# EAGLE design powersafe2 (EAGLE 7.7.0)
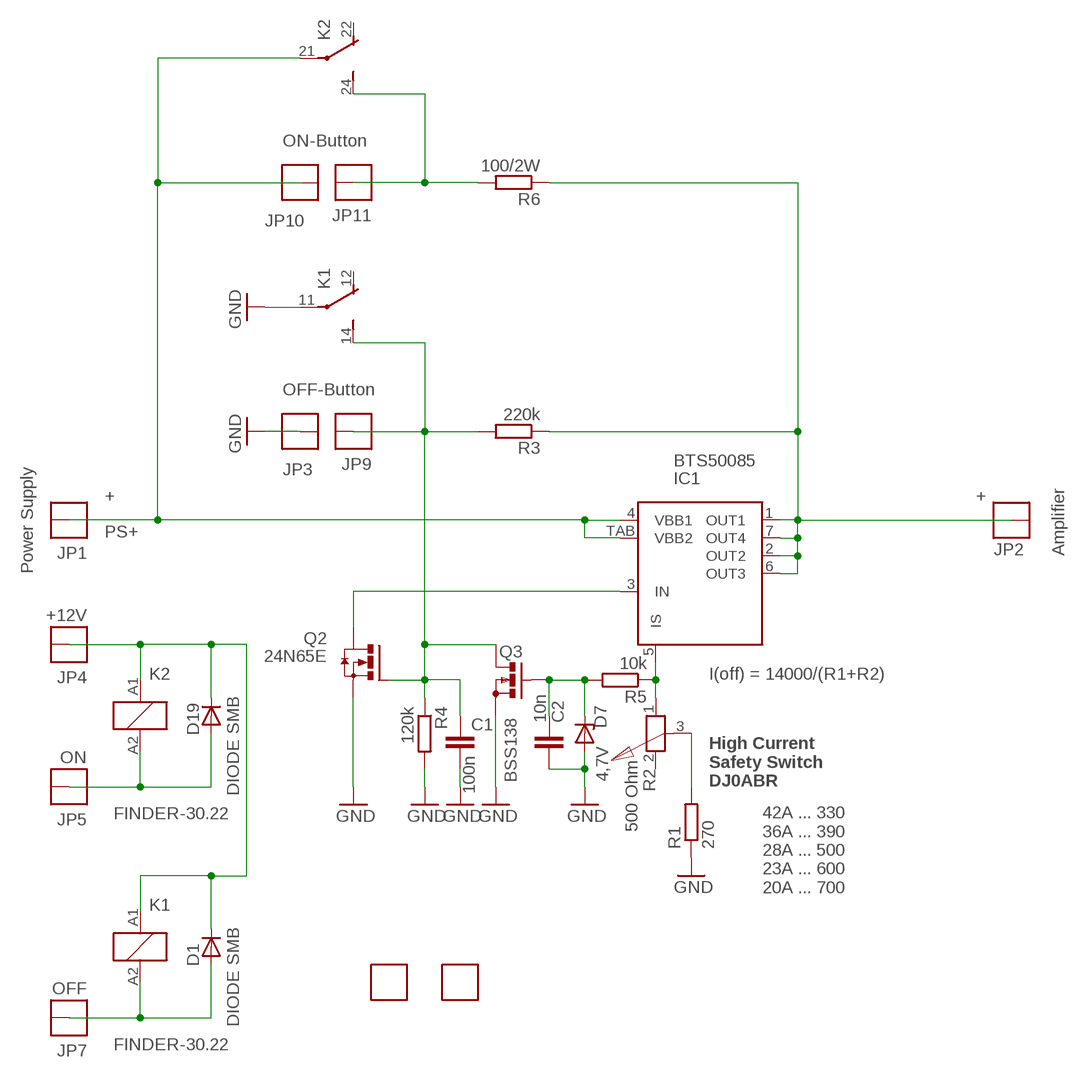
[diagram p0: schematic, sheet 1]

## Parts
C1  100n  C-EUC0603K  [C0603K]
C2  10n  C-EUC0603K  [C0603K]
D1  DIODE SMB  DIODE-SMB  [SMB]
D7  4,7V  ZPYSMA  [SMA]
D19  DIODE SMB  DIODE-SMB  [SMB]
FID1  FIDUCIAL  [FIDUCIAL]
FID2  FIDUCIAL  [FIDUCIAL]
IC1  BTS50085  [PG-TO220-7-4]
JP1  THICKPINPIN_4QMM  [PIN_4QMM]
JP2  THICKPINPIN_4QMM  [PIN_4QMM]
JP3  THICKPINSQUARE  [THICKPIN]
JP4  +12V  THICKPINOCT  [THICKPIN_OCT]
JP5  ON  THICKPINOCT  [THICKPIN_OCT]
JP7  OFF  THICKPINOCT  [THICKPIN_OCT]
JP9  THICKPINSQUARE  [THICKPIN]
JP10  THICKPINSQUARE  [THICKPIN]
JP11  THICKPINSQUARE  [THICKPIN]
K1  FINDER-30.22  [FINDER-30.22]
K2  FINDER-30.22  [FINDER-30.22]
Q2  24N65E  IRF3704S  [D2PACK]
Q3  BSS138  BS170_SMD  [SOT23]
R1  270  R-EU_R0603  [R0603]
R2  500 Ohm  MINIPOTI-S  [MINIPOTI]
R3  220k  R-EU_R0603  [R0603]
R4  120k  R-EU_R0603  [R0603]
R5  10k  R-EU_R0603  [R0603]
R6  100/2W  R-EU_0613/15  [P0613/15]

## Nets
GND: C1.2 C2.2 D7.A JP3.1 K1.11(-1:P) Q2.3(S) Q3.2(S) R1.1 R4.2
N$1: C2.1 D7.C Q3.1(G) R5.2
N$2: IC1.3(IN) Q2.2(D)
N$3: C1.1 JP9.1 K1.14(-1:S) Q2.1(G) Q3.3(D) R3.2 R4.1
N$4: IC1.5(IS) R2.1 R5.1
N$5: JP11.1 K2.24(-2:S) R6.2
N$7: D19.A JP5.1 K2.A2
N$8: D1.C D19.C JP4.1 K1.A1 K2.A1
N$9: R1.2 R2.3
N$10: D1.A JP7.1 K1.A2
PA+: IC1.1(OUT1) IC1.2(OUT2) IC1.6(OUT3) IC1.7(OUT4) JP2.P$1 R3.1 R6.1
PS+: IC1.4(VBB1) IC1.TAB(VBB2) JP1.P$1 JP10.1 K2.21(-2:P)
Unconnected: FID1.P$1 FID2.P$1 K1.12(-1:O) K1.21(-2:P) K1.22(-2:O) K1.24(-2:S) K2.11(-1:P) K2.12(-1:O) K2.14(-1:S) K2.22(-2:O) R2.2

## Notes on the sheet
- ON-Button
- OFF-Button
- + | +
- Amplifier
- Power Supply
- I(off) = 14000/(R1+R2)
- High Current
  Safety Switch
  DJ0ABR
- 42A ... 330
  36A ... 390
  28A ... 500
  23A ... 600
  20A ... 700

## Library data of the parts
C1 C2 = rcl:C-EU: CAPACITOR, European symbol
D1 D19 = diode:DIODE-: DIODE
D7 = km:ZPY: Z DIODE 1 W
FID1 FID2 = km:FIDUCIAL
IC1 = km:BTS50085
JP1-JP5 JP7 JP9-JP11 = km:THICKPIN
K1 K2 = relay:FINDER-30.22: SUBMINIATURE DIL-RELAIS FINDER 30.22.9.024.0000 Kontakt max. AC - 125V Distributor: Farnell Bestell Nr.: 1217371 Source: http://www.farnell.com/datasheets/87634.pdf; OC_FARNELL: unknown; OC_NEWARK: unknown
Q2 = km:IRF3704: SMPS MOSFET HEXFET® Power MOSFET Source: http://www.irf.com/product-info/datasheets/data/irf3704.pdf
Q3 = km:BS170_: N-CHANNEL MOS FET
R1 R3-R6 = rcl:R-EU_: RESISTOR, European symbol
R2 = km:MINIPOTI-S

## Net classes
1 dick: width 0.61 mm

## Board
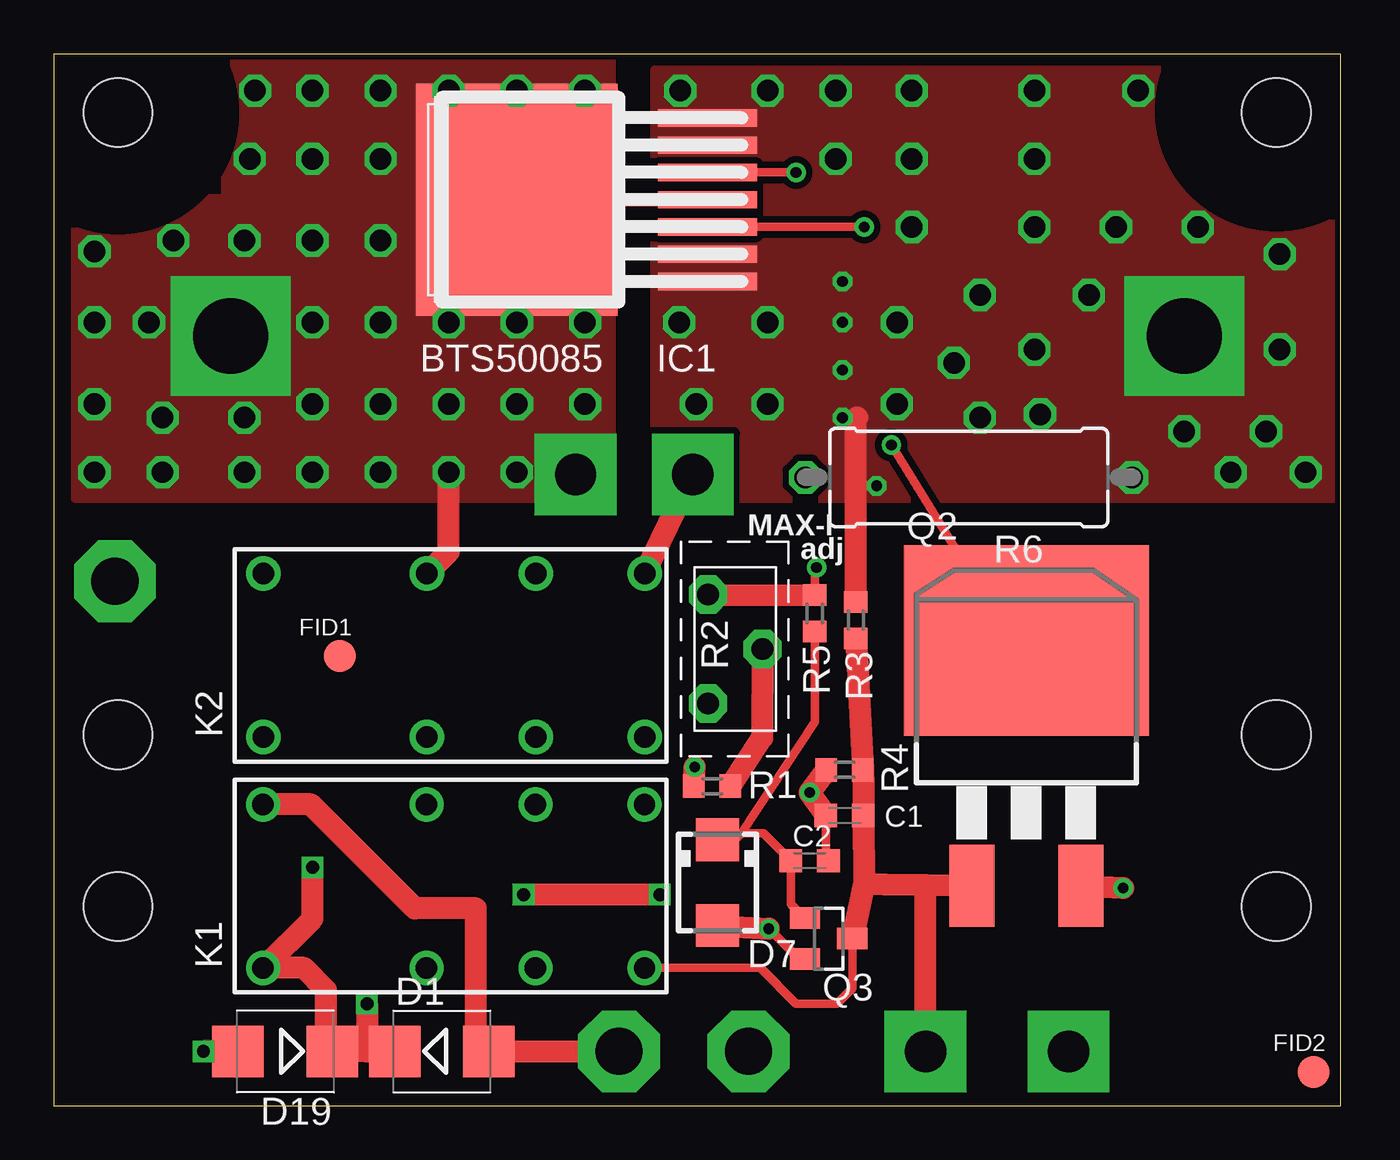
[diagram p1: board, top side]
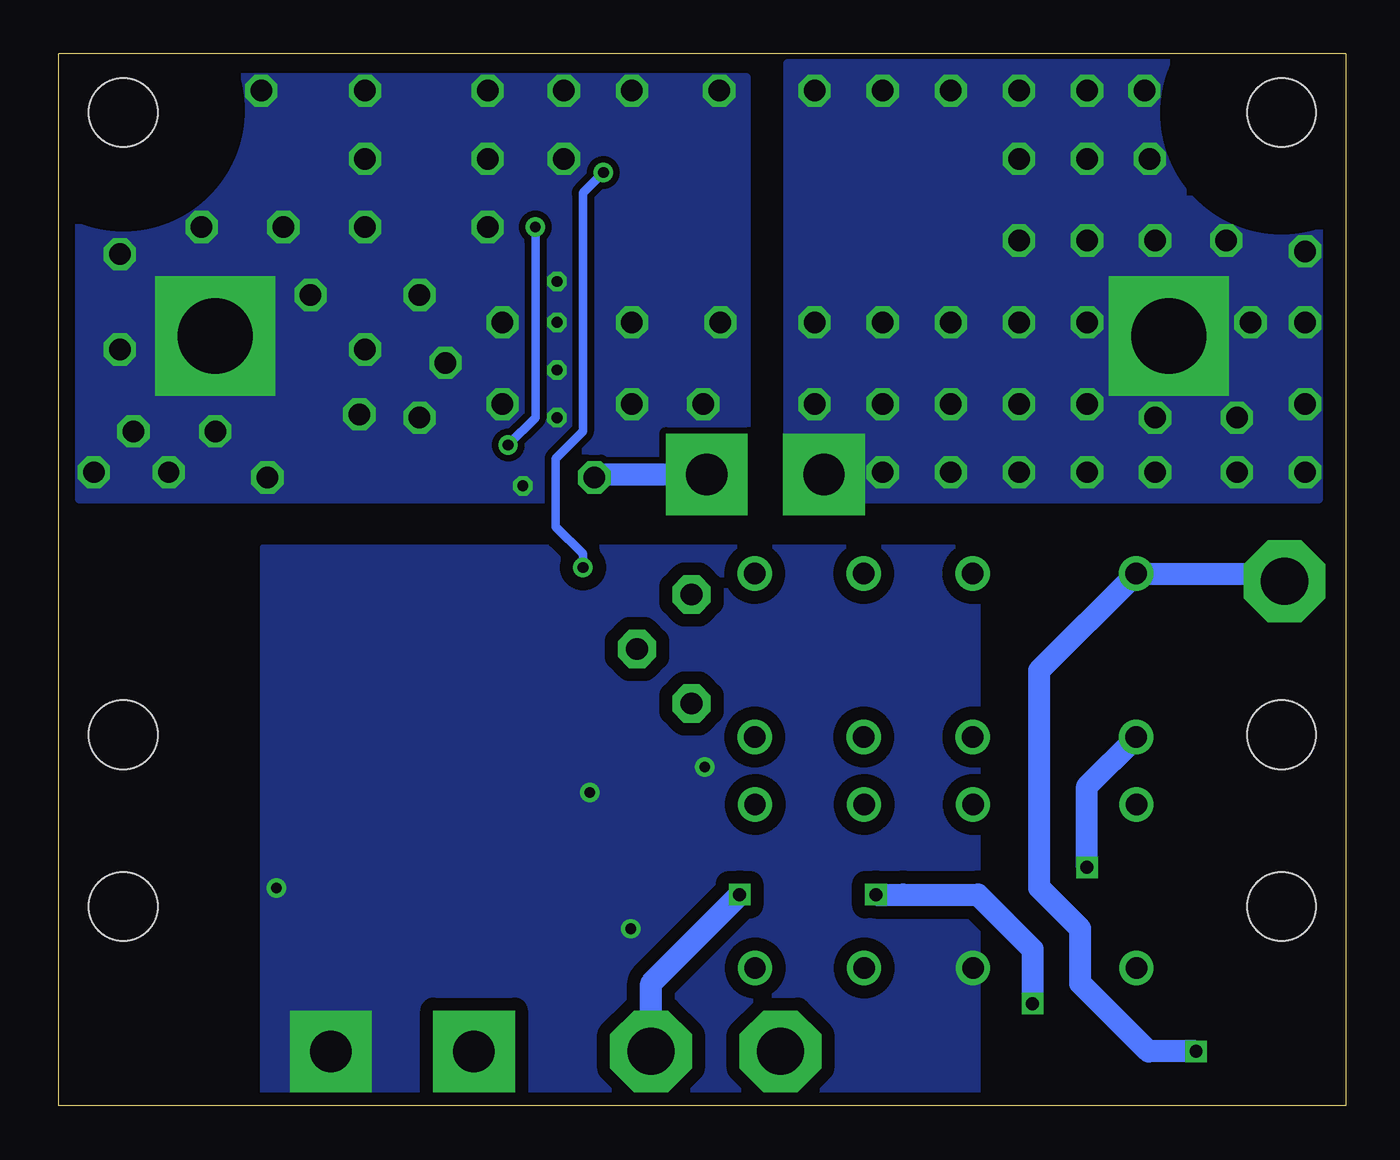
[diagram p2: board, bottom side, seen from below]

Size 60 x 49.03 mm. Coordinates in mm from the lower left corner, seen from the top.
Outline: 0,49.03 60,49.03 60,0 0,0 0,49.03
Copper layers (1*16): Top 0.035mm / dielectric 1.5mm / Bottom 0.035mm
Design rules "default *": minimum track width 10mil, minimum drill 0.25mm, track to track 12mil, track to pad 12mil, pad to pad 12mil, via to via 12mil, smd to smd 0mil, copper to edge 10mil, drill to drill 8mil, minimum pad ring 10mil, minimum via ring 8mil, stop-mask expansion 4mil, vias tented up to drill 1mm, thermal gap 10mil
Holes 3.2 mm at 3,17.29 3,46.29 57,46.29 57,17.29 3,9.29 57,9.29
tRestrict: area -2.7,40.6 to 8.7,51.9; area 51.3,40.7 to 62.7,52.1
bRestrict: area -1.2,12.7 to 7.6,21.6; area 51.9,12.2 to 62.4,22.7; area -2.7,40.6 to 8.7,51.9; area 51.3,40.7 to 62.7,52.1

### Footprints (pad centres in the part's own frame; a part is rotated, then mirrored left to right if it is on the bottom)
C0603K = smd 1.05 x 1.08: 1 -0.875,0; 2 0.875,0
SMB = smd 2.4 x 2.4: A 2.2,0; C -2.2,0
SMA = smd 2 x 2: A 2,0; C -2,0
FIDUCIAL = smd 1.5 x 1.5: P$1 0,0
PG-TO220-7-4 = smd 0.8 x 4.6: 1 -3.81,0; 2 -2.54,0; 3 -1.27,0; 4 0,0; 5 1.27,0; 6 2.54,0; 7 3.81,0 | smd 10.8 x 9.4: TAB 0,8.89
PIN_4QMM = drill 3.5 pad 5.588 square: P$1 0,0
THICKPIN = drill 1.93 pad 3.81 square: 1 0,0
THICKPIN_OCT = drill 2.2 pad 3.81 octagon: 1 0,0
FINDER-30.22 = drill 1 pad 1.6: 11 -1.27,-3.81; 12 3.81,-3.81; 14 8.89,-3.81; 21 -1.27,3.81; 22 3.81,3.81; 24 8.89,3.81; A1 -8.89,-3.81; A2 -8.89,3.81
D2PACK = smd 2.083 x 3.81: 1 -2.54,-8.89; 3 2.54,-8.89 | smd 11.43 x 8.89: 2 0,2.54
SOT23 = smd 1 x 1.4: 1 -0.95,-1.1; 2 0.95,-1.1; 3 0,1.1
R0603 = smd 1 x 1.1: 1 -0.85,0; 2 0.85,0
MINIPOTI = drill 1.016 pad 1.778 octagon: 1 -2.54,-2.54; 2 2.54,-2.54; 3 0,0
P0613/15 = drill 1.016 octagon: 1 -7.62,0; 2 7.62,0

### Placement (x,y rotation side)
C1  36.87,13.53 180 top
C2  35.24,11.43 0 top
D1  18.1,2.54 0 top
D7  30.94,10.41 270 top
D19  10.79,2.54 180 top
FID1  13.34,20.95 0 top
FID2  58.74,1.59 0 top
IC1  30.48,42.23 90 top
JP1  8.26,35.88 0 top
JP2  52.7,35.88 0 top
JP3  47.31,2.54 0 top
JP4  32.38,2.54 0 top
JP5  2.86,24.45 0 top
JP7  26.35,2.54 0 top
JP9  40.64,2.54 0 top
JP10  24.33,29.42 0 top
JP11  29.79,29.42 0 top
K1  18.65,10.24 0 top
K2  18.66,20.99 0 top
Q2  45.34,19.15 0 top
Q3  36.12,7.8 270 top
R1  30.7,14.9 0 top
R2  33.05,21.29 270 top
R3  37.4,22.64 270 top
R4  36.87,15.66 180 top
R5  35.48,22.95 270 top
R6  42.66,29.28 180 top

### Tracks (layer width: path | path; a pad name or v marks a point on that pad's centre or on a via)
GND  (via drill 0.5)
  Top 0.406: C2.2 36,11.43 C1.2 | Q3.2 34.74,6.85 v33.34,8.26
  Top 1.016: D7.A v33.34,8.26 | R1.1 v29.88,15.8 | R4.2 v35.24,14.6 C1.2 | Q2.3 v49.85,10.16
  pour Bottom (isolate 0.61, no thermals): 17.14,26.04 50.48,26.04 50.48,0.32 17.14,0.32
N$1
  Top 0.406: R5.2 35.48,17.89 32.07,12.7 | 32.07,12.7 31.77,12.41 31.43,12.41 D7.C | 32.07,12.7 33.1,12.7 C2.1 34.37,9.41 Q3.1
N$2  (via drill 0.5)
  Top 0.406: IC1.3 33.66,40.96 v37.78,40.96 | v39.05,30.8 44.67,21.69 Q2.2
  Bottom 0.406: v37.78,40.96 37.78,40.32 37.78,32.07 v39.05,30.8
N$3
  Top 0.406: K1.14 32.94,6.43 34.61,4.76 36.51,4.76 37.23,5.47 Q3.3
  Top 1.016: Q2.1 40.65,10.29 | 40.65,10.29 38.74,10.31 37.78,10.33 | 37.78,10.33 Q3.3 | 37.78,10.33 C1.1 arc5 R4.1 R3.2 | JP9.1 40.65,10.29
N$4  (via drill 0.5)
  Top 0.406: IC1.5 v34.61,43.5 | v35.56,25.08 35.48,25 R5.1
  Top 1.016: R2.1 R5.1
  Bottom 0.406: v34.61,43.5 35.56,42.55 35.56,31.43 36.83,30.16 36.83,26.99 35.56,25.72 v35.56,25.08
N$5
  Top 1.016: K2.24 JP11.1
  Bottom 1.016: JP11.1 35.03,29.42 R6.2
N$7  (via drill 0.6)
  Top 1.016: D19.A v6.99,2.54
  Bottom 1.016: JP5.1 3.21,24.8 K2.A2 14.29,20.29 14.29,10.16 12.38,8.26 12.38,5.72 9.21,2.54 v6.99,2.54
N$8  (via drill 0.6)
  Top 1.016: D1.C 14.61,2.54 | 14.61,2.54 D19.C 12.7,2.84 12.7,5.4 11.67,6.43 K1.A1 12.06,8.73 v12.06,11.11 | v14.61,4.76 14.61,2.54 | v28.26,9.84 v21.91,9.84
  Bottom 1.016: v12.06,11.11 12.06,14.89 K2.A1 | JP4.1 32.38,5.72 v28.26,9.84 | v14.61,4.76 14.61,7.3 17.14,9.84 20.64,9.84 v21.91,9.84
N$9
  Top 1.016: R2.3 33.02,17.15 R1.2
N$10
  Top 1.016: JP7.1 D1.A 19.68,2.54 19.68,9.21 16.83,9.21 13.02,13.02 11.99,14.05 K1.A2
PA+  (via drill 0.5, 1)
  Top 1.016: R3.1 37.4,32 37.47,32.07
  other vias: 29.21,47.31 40.01,47.31 40.01,44.13 40.01,40.96 45.72,47.31 45.72,44.13 50.56,47.31 45.72,35.24 45.72,40.96 53.34,40.96 43.18,37.78 43.18,32.07 49.53,40.96 48.26,37.78 52.7,31.43 56.52,31.43 57.15,35.24 57.15,39.69 29.95,32.7 29.16,36.51 33.28,32.7 33.28,36.51 39.31,36.51 39.31,32.7 41.97,34.63 45.98,32.23 54.87,29.53 58.37,29.53 33.28,47.31 36.46,47.31 36.46,44.13 38.36,28.89 36.77,32.07 36.77,34.29 36.77,36.51 36.77,38.42
  pour Top (no thermals): 28,48.29 28,28.29 60,28.29 60,42.29 54,42.29 54,48.29
  pour Bottom (no thermals): 27.94,47.94 27.94,28.26 59.05,28.26 59.05,42.23 53.98,42.23 53.98,47.94
PS+  (via drill 1)
  Top 0.61: IC1.TAB IC1.4
  Top 1.016: K2.21 18.41,25.82 v18.41,29.53
  other vias: 9.39,47.31 18.41,47.31 15.24,47.31 12.06,47.31 9.14,44.13 12.06,44.13 15.24,44.13 8.89,40.32 12.06,40.32 15.24,40.32 5.58,40.32 1.91,39.82 1.91,36.51 1.91,32.7 1.91,29.53 5.08,29.53 8.89,29.53 12.06,29.53 15.24,29.53 15.24,32.7 15.24,36.51 12.06,36.51 12.06,32.7 24.77,47.31 21.59,47.31 8.89,32.07 5.08,32.07 4.45,36.51 21.59,29.53 18.41,36.51 18.41,32.7 21.59,36.51 24.77,36.51 21.59,32.7 24.77,32.7
  pour Top (no thermals): 1,28.29 26,28.29 26,49.29 8,49.29 8,42.29 1,42.29
  pour Bottom (no thermals): 26.04,48.58 26.04,28.26 1.27,28.26 1.27,42.23 7.62,42.23 7.62,48.58

### Text on the board
tNames: MAX-I | adj
Document: IN | OUT | On | Rel / ON | DJ0ABR | High Current / Security Switch | +12 | OFF | GND | Rel | OFF